# Altium project IOT_20232.PrjPcb
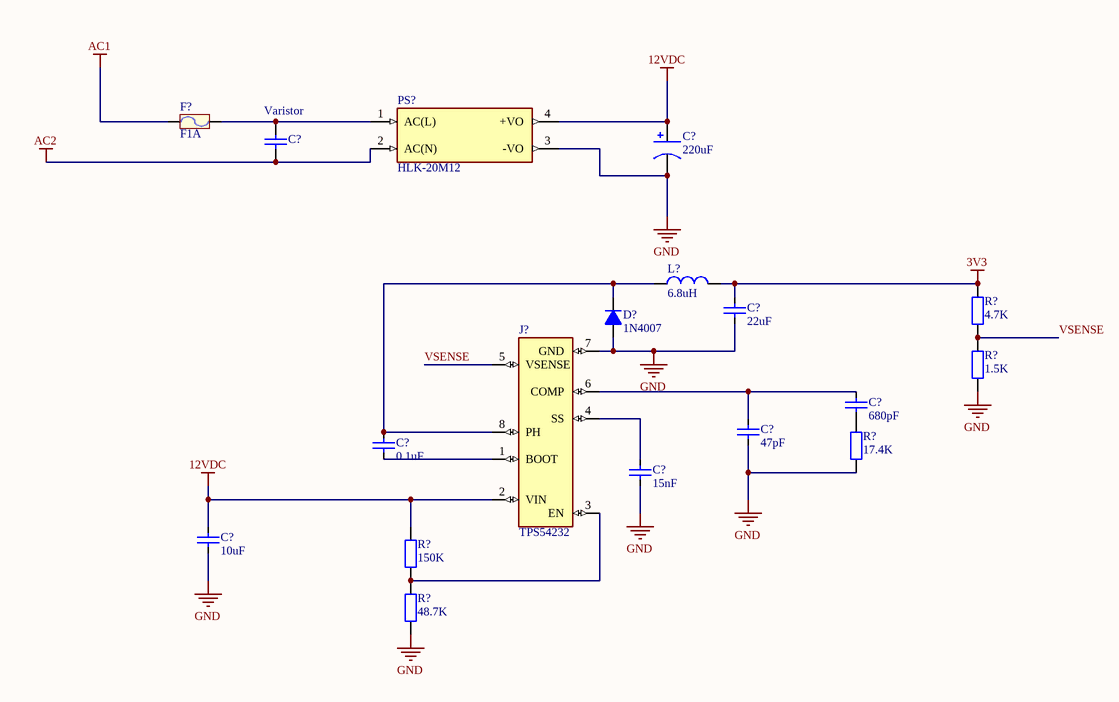
[diagram p0: 1.POWER.SchDoc]
3 sheets, 18 parts. Net scope: global (net labels, ports and power ports of the same name join across sheets).
Sheets:
  2.RELAY.SchDoc
  4.SENSOR.SchDoc
  1.POWER.SchDoc

## Sheet 2.RELAY.SchDoc
size A4; SheetNumber: 3; SheetTotal: 3

## Sheet 4.SENSOR.SchDoc
size A4; SheetNumber: 5; SheetTotal: 5

## Sheet 1.POWER.SchDoc
size A4; SheetNumber: 5; SheetTotal: 5

### Parts
(Parts that share a designator on the sheet are numbered #1, #2 ... from top to bottom, then left to right.)
C?#1  Varistor  [CAP_CERAMIC]
C?#2  220uF  [C3MM]
C?#3  22uF  [CAP_0402]
C?#4  680pF  [CAP_0402]
C?#5  47pF  [CAP_0402]
C?#6  0.1uF  [CAP_0402]
C?#7  15nF  [CAP_0402]
C?#8  10uF  [CAP_0402]
D?  1N4007  [D1A]
F?  F1A  [Fuse]
J?  TPS54232  [SOIC8]
L?  6.8uH  [L-SMD-M-12x10]
PS?  HLK-20M12  [CONV_HLK-20M12]
R?#1  4.7K  [RES-SMD-0101]
R?#2  1.5K  [RES-SMD-0101]
R?#3  17.4K  [RES-SMD-0101]
R?#4  150K  [RES-SMD-0101]
R?#5  48.7K  [RES-SMD-0101]

### Nets
3V3: C?#3.1 L?.2 R?#1.2
12VDC: C?#2.1 C?#8.1 J?.2(VIN) PS?.4(+VO) R?#4.2
AC1: F?.1
AC2: C?#1.2 PS?.2(AC(N))
GND: C?#2.2 C?#3.2 C?#5.2 C?#7.2 C?#8.2 D?.1(A) J?.7(GND) PS?.3(-VO) R?#2.1 R?#3.1 R?#5.1
VSENSE: J?.5(VSENSE) R?#1.1 R?#2.2
NetC?#1_1: C?#1.1 F?.2 PS?.1(AC(L))
NetC?#4_1: C?#4.1 C?#5.1 J?.6(COMP)
NetC?#4_2: C?#4.2 R?#3.2
NetC?#6_1: C?#6.1 D?.2(K) J?.8(PH) L?.1
NetC?#6_2: C?#6.2 J?.1(BOOT)
NetC?#7_1: C?#7.1 J?.4(SS)
NetJ?_3: J?.3(EN) R?#4.1 R?#5.2

### Library data of the parts
C?#1 = CapCeramic: Capacitor; Value: 33p; Published: 8-Jun-2000; LatestRevisionDate: 17-Jul-2002; LatestRevisionNote: Re-released for DXP Platform.; PackageReference: RAD-0.3; Publisher: Altium Limited
C?#2 = Cap Pol: Polarized Capacitor (Axial); Published: 8-Jun-2000; LatestRevisionDate: 17-Jul-2002; LatestRevisionNote: Re-released for DXP Platform.; PackageReference: POLAR0.8; Publisher: Altium Limited
C?#3-C?#8 = CapSMD: Capacitor; Value: 33p; Published: 8-Jun-2000; LatestRevisionDate: 17-Jul-2002; LatestRevisionNote: Re-released for DXP Platform.; PackageReference: RAD-0.3; Publisher: Altium Limited
D? = D1A: Diode 1A; Value: 1N4007
F? = Fuse: Designed by: VanDungEvn; Value: Fuse
J? = TPS54232: Buck Switching Regulator IC Positive Adjustable 0.8V 1 Output 2A 8-SOIC (0.154, 3.90mm Width); MF: Texas Instruments; SnapEDA_Link: https://www.snapeda.com/parts/TPS54232/Texas+Instruments/view-part/?ref=snap; Package: - Texas Instruments; Value: *; MP: TPS54232; Check_prices: https://www.snapeda.com/parts/TPS54232/Texas+Instruments/view-part/?ref=eda
L? = Inductor: Value: 150 mH
PS? = HLK-20M12: 20W ultra-small series module power supply; MF: Hi-link; Check_prices: https://www.snapeda.com/parts/HLK-20M12/Hi-link/view-part/?ref=eda; SnapEDA_Link: https://www.snapeda.com/parts/HLK-20M12/Hi-link/view-part/?ref=snap; Availability: Not in stock; Price: None; Value: *; MP: HLK-20M12; Package: Non-Standard Hi-link
R?#1-R?#5 = Resistor - SMD: Resistor SMD; Manufacturer: Generic Components; Class: Passive; Published: 08/06/2000; Publisher: Altium Hobart Technology Centre